# EAGLE design Pico Audio v0.13 (EAGLE 9.4.2)
COMPANY: AKSevenFour; CREVISION: v0.13; DATE: 30-10-2018; DRAWN: Adam Keher; TITLE: TinyPICO Audio Board
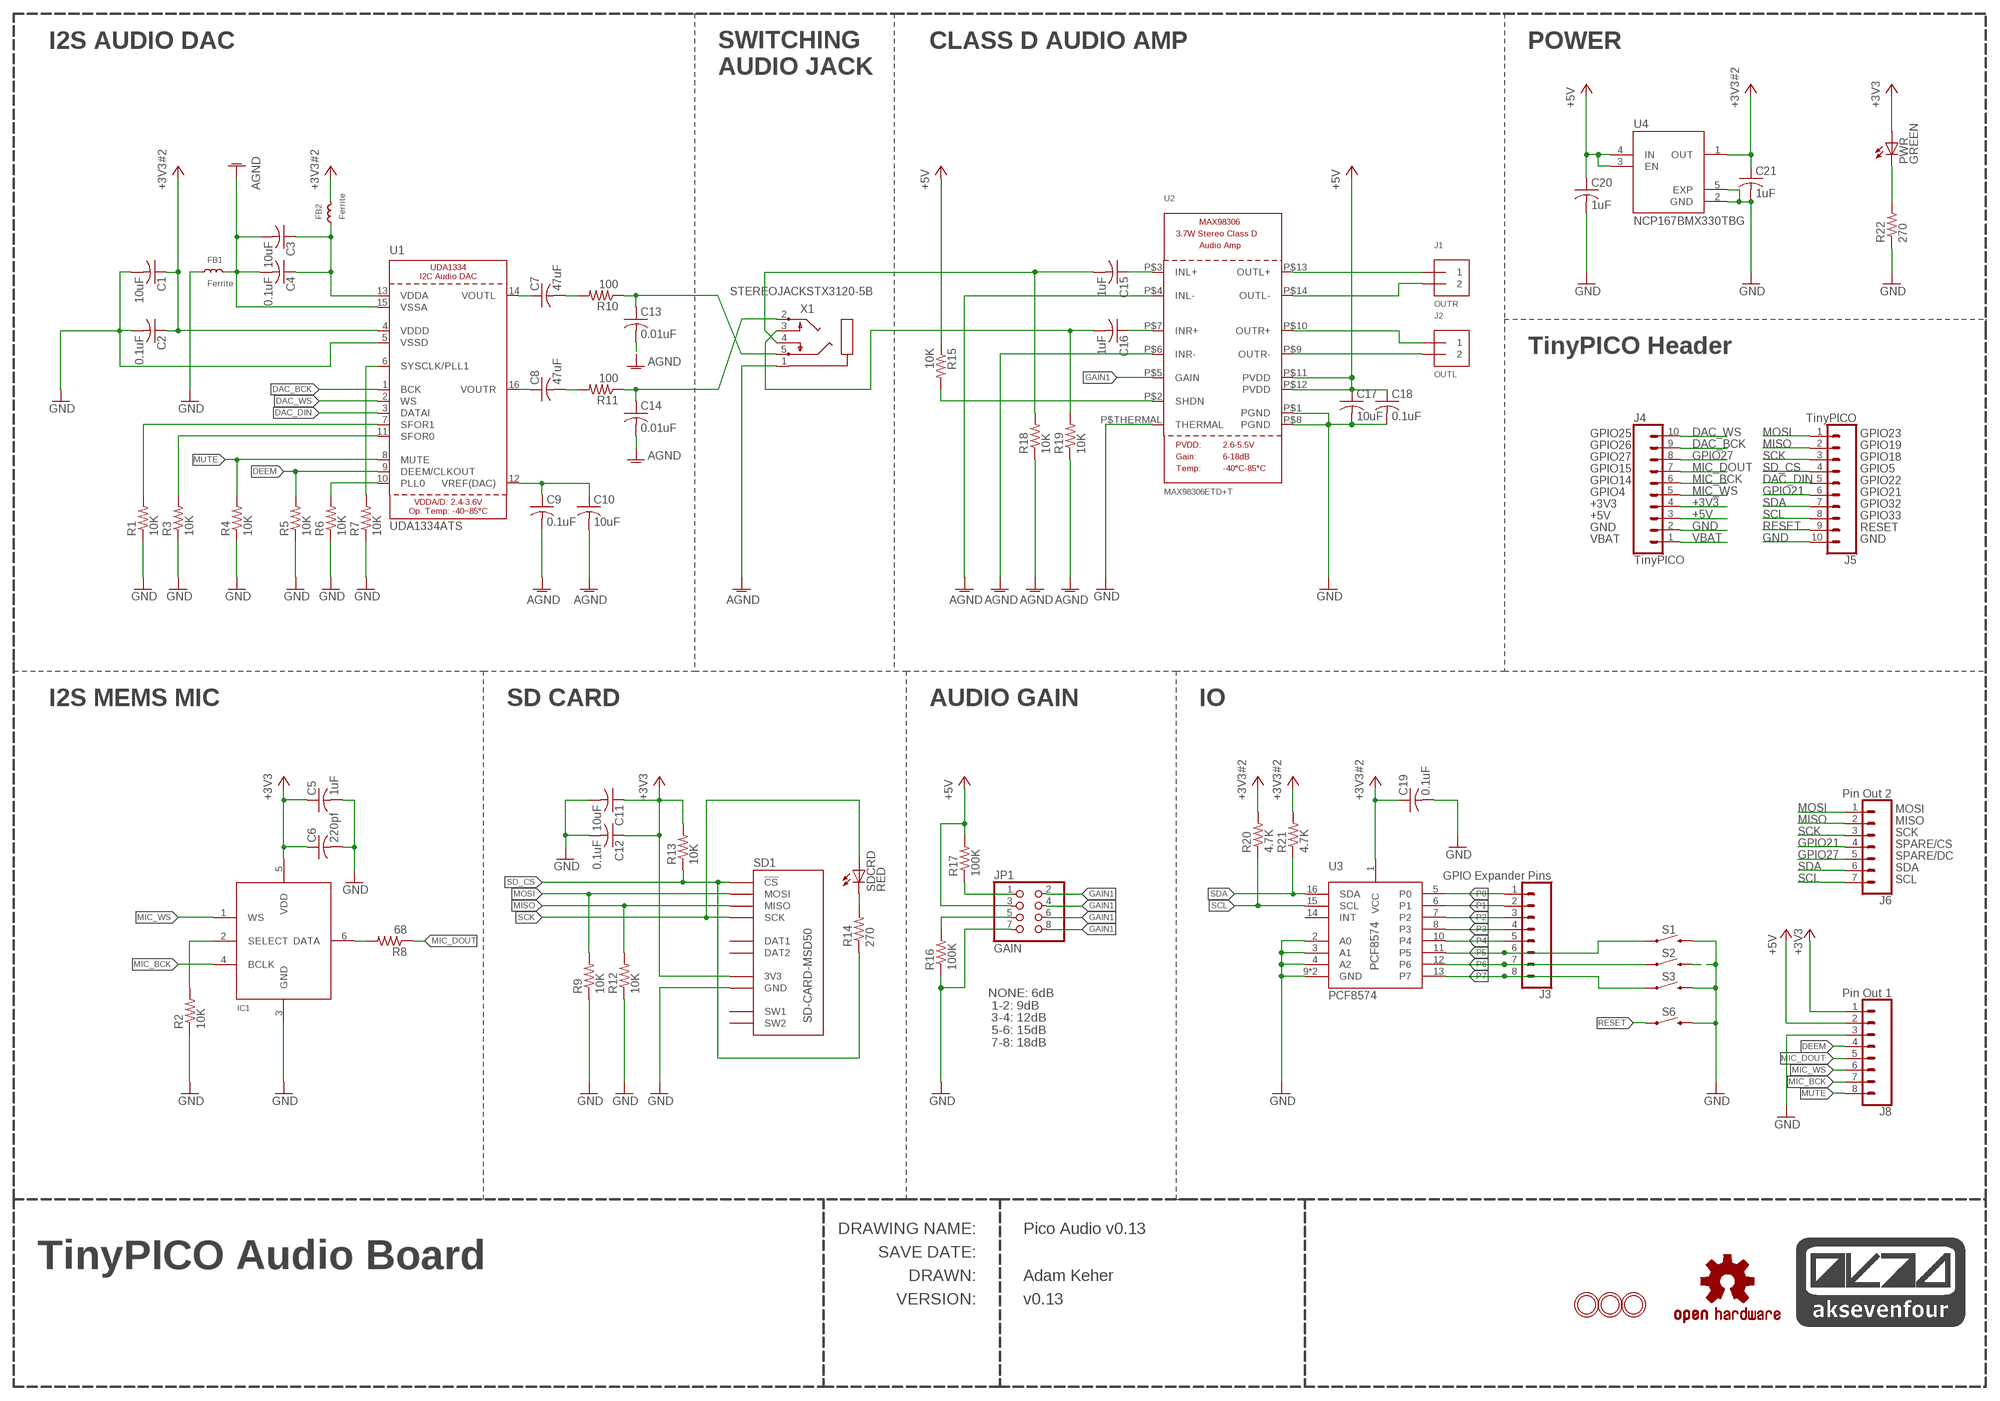
[diagram p0: schematic, sheet 1]

## Parts
AK74LOGO2  AK74_LOGOAK74_LOGO_SMALL  [AK74_LOGO_MEDIUM]
C1  10uF  C-USC0603K  [C0603K]
C2  0.1uF  C-USC0402K  [C0402K]
C3  10uF  C-USC0603K  [C0603K]
C4  0.1uF  C-USC0402K  [C0402K]
C5  1uF  C-USC0402K  [C0402K]
C6  220pf  C-USC0402K  [C0402K]
C7  47uF  C-USC1210K  [C1210K]
C8  47uF  C-USC1210K  [C1210K]
C9  0.1uF  C-USC0402K  [C0402K]
C10  10uF  C-USC0603K  [C0603K]
C11  10uF  C-USC0603K  [C0603K]
C12  0.1uF  C-USC0402K  [C0402K]
C13  0.01uF  C-USC0402K  [C0402K]
C14  0.01uF  C-USC0402K  [C0402K]
C15  1uF  C-USC0402K  [C0402K]
C16  1uF  C-USC0402K  [C0402K]
C17  10uF  C-USC0603K  [C0603K]
C18  0.1uF  C-USC0402K  [C0402K]
C19  0.1uF  C-USC0402K  [C0402K]
C20  1uF  C-USC0402K  [C0402K]
C21  1uF  C-USC0402K  [C0402K]
FB1  Ferrite  FERRITEL0805  [R0805]
FB2  Ferrite  FERRITEL0805  [R0805]
IC1  MIC_I2S_SPH0645  [SPH0645LM4H]
J1  OUTR  TERMBLOCK_1X2  [TERMBLOCK_1X2-3.5MM]
J2  OUTL  TERMBLOCK_1X2  [TERMBLOCK_1X2-3.5MM]
J3  GPIO Expander Pins  CONN_08NO_SILK_FEMALE_PTH  [1X08_NO_SILK]
J4  TinyPICO  TINYPICO_HEADER_10NO_SILK_PTH_FEMALE  [1X10_NO_SILK]
J5  TinyPICO  TINYPICO_HEADER_10NO_SILK_PTH_FEMALE  [1X10_NO_SILK]
J6  Pin Out 2  CONN_07NO_SILK  [1X07_NO_SILK]
J8  Pin Out 1  CONN_08NO_SILK_FEMALE_PTH  [1X08_NO_SILK]
JP1  GAIN  PINHD-2X4  [2X04]
LOGO1  OSHW-LOGOM  [OSHW-LOGO-M]
MH1  MOUNTINGHOLE2.5  [MOUNTINGHOLE_2.5_PLATED]
MH2  MOUNTINGHOLE2.5  [MOUNTINGHOLE_2.5_PLATED]
MH3  MOUNTINGHOLE2.5  [MOUNTINGHOLE_2.5_PLATED]
PWR  GREEN  LEDCHIP-LED0805  [CHIP-LED0805]
R1  10K  R-US_R0402  [R0402]
R2  10K  R-US_R0402  [R0402]
R3  10K  R-US_R0402  [R0402]
R4  10K  R-US_R0402  [R0402]
R5  10K  R-US_R0402  [R0402]
R6  10K  R-US_R0402  [R0402]
R7  10K  R-US_R0402  [R0402]
R8  68  R-US_R0402  [R0402]
R9  10K  R-US_R0402  [R0402]
R10  100  R-US_R0402  [R0402]
R11  100  R-US_R0402  [R0402]
R12  10K  R-US_R0402  [R0402]
R13  10K  R-US_R0402  [R0402]
R14  270  R-US_R0402  [R0402]
R15  10K  R-US_R0402  [R0402]
R16  100K  R-US_R0402  [R0402]
R17  100K  R-US_R0402  [R0402]
R18  10K  R-US_R0402  [R0402]
R19  10K  R-US_R0402  [R0402]
R20  4.7K  R-US_R0402  [R0402]
R21  4.7K  R-US_R0402  [R0402]
R22  270  R-US_R0402  [R0402]
S1  MOMENTARY-SWITCH-SPST-SMD-4.6X2.8MM  [TACTILE_SWITCH_SMD_4.6X2.8MM]
S2  MOMENTARY-SWITCH-SPST-SMD-4.6X2.8MM  [TACTILE_SWITCH_SMD_4.6X2.8MM]
S3  MOMENTARY-SWITCH-SPST-SMD-4.6X2.8MM  [TACTILE_SWITCH_SMD_4.6X2.8MM]
S6  MOMENTARY-SWITCH-SPST-SMD-4.6X2.8MM  [TACTILE_SWITCH_SMD_4.6X2.8MM]
SD1  SD-CARD-MSD50  [SD_5031821853]
SDCRD  RED  LEDCHIP-LED0805  [CHIP-LED0805]
U1  UDA1334ATS  AUDIO_I2S_UDA1334""  [SSOP16_4.4MM]
U2  MAX98306ETD+T  AUDIOAMP_MAX98306  [TDFN14_3X3MM]
U3  PCF8574  [QFN-16-3MM]
U4  NCP170AMX300TCG  [VREG_NCP170AMX300TCG]
X1  STEREOJACKSTX3120-5B  [STX3100]

## Nets
+3V3 [power1]: C5.1 C6.1 C11.1 C12.1 IC1.5(VDD) J4.4 J8.1 PWR.A R13.2 SD1.VCC(3V3)
+3V3#2 [power1]: C1.1 C2.1 C19.1 C21.1 FB2.2 R20.2 R21.2 U1.4(VDDD) U3.1(VCC) U4.1(OUT)
+5V [power1]: C17.1 C18.1 C20.1 J4.3 J8.2 JP1.3 R15.1 R17.2 U2.P$11(PVDD) U2.P$12(PVDD) U4.3(EN) U4.4(IN)
AGND [power1]: C3.2 C4.2 C9.2 C10.2 C13.2 C14.2 FB1.2 R18.1 R19.1 U1.15(VSSA) U2.P$4(INL-) U2.P$6(INR-) X1.1
DAC_BCK: J4.9 U1.1(BCK)
DAC_DIN: J5.5 U1.3(DATAI)
DAC_WS: J4.10 U1.2(WS)
DEEM: J8.4 R5.2 U1.9(DEEM/CLKOUT)
GAIN1: JP1.2 JP1.4 JP1.6 JP1.8 U2.P$5(GAIN)
GND [power1]: C1.2 C2.2 C5.2 C6.2 C11.2 C12.2 C17.2 C18.2 C19.2 C20.2 C21.2 FB1.1 IC1.3(GND) J4.2 J5.10 J8.3 JP1.7 R1.1 R2.1 R3.1 R4.1 R5.1 R6.1 R7.1 R9.1 R12.1 R16.1 R22.1 S1.3 S1.4 S2.3 S2.4 S3.3 S3.4 S6.3 S6.4 SD1.GND U1.5(VSSD) U2.P$1(PGND) U2.P$8(PGND) U2.P$THERMAL(THERMAL) U3.2(A0) U3.3(A1) U3.4(A2) U3.9(GND) U3.P$1(GND) U4.2(GND) U4.5(EXP)
GPIO21: J5.6 J6.4
GPIO27: J4.8 J6.5
MIC_BCK: IC1.4(BCLK) J4.6 J8.7
MIC_DOUT: J4.7 J8.5 R8.1
MIC_WS: IC1.1(WS) J4.5 J8.6
MISO: J5.2 J6.2 R12.2 SD1.MISO
MOSI: J5.1 J6.1 R9.2 SD1.MOSI
MUTE: J8.8 R4.2 U1.8(MUTE)
N$1: C3.1 C4.1 FB2.1 U1.13(VDDA)
N$2: C15.1 U2.P$3(INL+)
N$3: R1.2 U1.7(SFOR1)
N$4: C16.1 U2.P$7(INR+)
N$5: R3.2 U1.11(SFOR0)
N$8: PWR.C R22.2
N$10: R6.2 U1.10(PLL0)
N$11: R7.2 U1.6(SYSCLK/PLL1)
N$14: C9.1 C10.1 U1.12(VREF(DAC))
N$15: C7.1 U1.14(VOUTL)
N$16: C8.2 R11.2
N$17 [power1]: J2.2 U2.P$9(OUTR-)
N$18 [power1]: J1.2 U2.P$14(OUTL-)
N$19: C7.2 R10.2
N$20: IC1.2(SELECT) R2.2
N$21: C8.1 U1.16(VOUTR)
N$22: IC1.6(DATA) R8.2
N$24: JP1.1 R17.1
N$25: JP1.5 R16.2
N$26 [power1]: J1.1 U2.P$13(OUTL+)
N$27: R14.2 SDCRD.C
N$28 [power1]: J2.1 U2.P$10(OUTR+)
P0: J3.1 U3.5(P0)
P1: J3.2 U3.6(P1)
P2: J3.3 U3.7(P2)
P3: J3.4 U3.8(P3)
P4: J3.5 U3.10(P4)
P5: J3.6 S1.1 S1.2 U3.11(P5)
P6: J3.7 S2.1 S2.2 U3.12(P6)
P7: J3.8 S3.1 S3.2 U3.13(P7)
RESET: J5.9 S6.1 S6.2
SCK: J5.3 J6.3 SD1.SCK SDCRD.A
SCL: J5.8 J6.7 R20.1 U3.15(SCL)
SD_CS: J5.4 R13.1 R14.1 SD1.CS(!CS)
SDA: J5.7 J6.6 R21.1 U3.16(SDA)
SHUTDOWN: R15.2 U2.P$2(SHDN)
VBAT [power1]: J4.1
VINL [power1]: C15.2 R18.2 X1.4
VINR [power1]: C16.2 R19.2 X1.3
VOUTL [power1]: C13.1 R10.1 X1.5
VOUTR [power1]: C14.1 R11.1 X1.2
Unconnected: SD1.DAT1 SD1.DAT2 SD1.SW1 SD1.SW2 U3.14(INT)

## Notes on the sheet
- I2S AUDIO DAC | CLASS D AUDIO AMP | POWER
- SWITCHING
  AUDIO JACK
- NCP167BMX330TBG
- TinyPICO Header
- GPIO25 | GPIO23
- GPIO26 | GPIO19
- GPIO27 | GPIO18
- GPIO15 | GPIO5
- GPIO14 | GPIO22
- GPIO4 | GPIO21
- +3V3 | GPIO32
- +5V | GPIO33
- GND | RESET
- VBAT | GND
- I2S MEMS MIC | SD CARD | AUDIO GAIN | IO
- MOSI
- MISO
- SCK
- SPARE/CS
- SPARE/DC
- SDA
- SCL
- NONE: 6dB
   1-2: 9dB
   3-4: 12dB
   5-6: 15dB
   7-8: 18dB
- DRAWING NAME:
- SAVE DATE:
- DRAWN:
- VERSION:

## Library data of the parts
AK74LOGO2 = AK74:AK74_LOGO
C1-C21 = rcl:C-US: CAPACITOR, American symbol; SPICEPREFIX: C
FB1 FB2 = AK74:FERRITE
IC1 = microbuilder:MIC_I2S
J1 J2 = microbuilder:TERMBLOCK_1X2: 3.5mm Terminal block http://www.ladyada.net/library/pcb/eaglelibrary.html
J3 J8 = SparkFun-Connectors:CONN_08: Multi connection point. Often used as Generic Header-pin footprint for 0.1 inch spaced/style header connections On any of the 0.1 inch spaced packages, you can populate with these: Break Away Headers - Straight (PRT-00116) Break Away Male Headers - Right Angle (PRT-00553) Female Headers (PRT-00115) Break Away Headers - Machine Pin (PRT-00117) Break Away Female Headers - Swiss Machine Pin (PRT-00743) Arduino Stackable Header - 8 Pin (PRT-09279) For SCREWTERMINALS and SPRING TERMINALS visit here: Screw Terimnals on SparkFun.com (5mm/3.5mm/2.54mm spacing) This device is also useful as a general connection point to wire up your design to another part of your project. Our various solder wires solder well into these plated through hole pads. Hook-Up Wire - Assortment (Stranded, 22 AWG) (PRT-11375) Hook-Up Wire - Assortment (Solid Core, 22 AWG) (PRT-11367) View the entire wire category on our website here Special notes: Molex polarized connector foot print use with SKU : PRT-08231 with associated crimp pins and housings. 1MM SMD Version SKU: PRT-10208 NOTES ON THE VARIANTS LOCK and LOCK_LONGPADS... This footprint was designed to help hold the alignment of a through-hole component (i.e. 6-pin header) while soldering it into place. You may notice that each hole has been shifted either up or down by 0.005 of an inch from it's more standard position (which is a perfectly straight line). This slight alteration caused the pins (the squares in the middle) to touch the edges of the holes. Because they are alternating, it causes a "brace" to hold the component in place. 0.005 has proven to be the perfect amount of "off-center" position when using our standard breakaway headers. Although looks a little odd when you look at the bare footprint, once you have a header in there, the alteration is very hard to notice. Also,if you push a header all the way into place, it is covered up entirely on the bottom side.; PROD_ID: CONN-08438
J4 J5 = UnexpectedMaker:TINYPICO_HEADER_10: Multi connection point. Often used as Generic Header-pin footprint for 0.1 inch spaced/style header connections On any of the 0.1 inch spaced packages, you can populate with these: Break Away Headers - Straight (PRT-00116) Break Away Male Headers - Right Angle (PRT-00553) Female Headers (PRT-00115) Break Away Headers - Machine Pin (PRT-00117) Break Away Female Headers - Swiss Machine Pin (PRT-00743) Arduino Stackable Header - 10 Pin (PRT-11376) For SCREWTERMINALS and SPRING TERMINALS visit here: Screw Terimnals on SparkFun.com (5mm/3.5mm/2.54mm spacing) This device is also useful as a general connection point to wire up your design to another part of your project. Our various solder wires solder well into these plated through hole pads. Hook-Up Wire - Assortment (Stranded, 22 AWG) (PRT-11375) Hook-Up Wire - Assortment (Solid Core, 22 AWG) (PRT-11367) View the entire wire category on our website here Special notes: Molex polarized connector foot print use with SKU : PRT-08231 with associated crimp pins and housings. 1MM SMD Version SKU: PRT-10208 NOTES ON THE VARIANTS LOCK and LOCK_LONGPADS... This footprint was designed to help hold the alignment of a through-hole component (i.e. 6-pin header) while soldering it into place. You may notice that each hole has been shifted either up or down by 0.005 of an inch from it's more standard position (which is a perfectly straight line). This slight alteration caused the pins (the squares in the middle) to touch the edges of the holes. Because they are alternating, it causes a "brace" to hold the component in place. 0.005 has proven to be the perfect amount of "off-center" position when using our standard breakaway headers. Although looks a little odd when you look at the bare footprint, once you have a header in there, the alteration is very hard to notice. Also,if you push a header all the way into place, it is covered up entirely on the bottom side.; PROD_ID: CONN-11563
J6 = SparkFun-Connectors:CONN_07: Multi connection point. Often used as Generic Header-pin footprint for 0.1 inch spaced/style header connections On any of the 0.1 inch spaced packages, you can populate with these: Break Away Headers - Straight (PRT-00116) Break Away Male Headers - Right Angle (PRT-00553) Female Headers (PRT-00115) Break Away Headers - Machine Pin (PRT-00117) Break Away Female Headers - Swiss Machine Pin (PRT-00743) For SCREWTERMINALS and SPRING TERMINALS visit here: Screw Terimnals on SparkFun.com (5mm/3.5mm/2.54mm spacing) This device is also useful as a general connection point to wire up your design to another part of your project. Our various solder wires solder well into these plated through hole pads. Hook-Up Wire - Assortment (Stranded, 22 AWG) (PRT-11375) Hook-Up Wire - Assortment (Solid Core, 22 AWG) (PRT-11367) View the entire wire category on our website here Special notes: Molex polarized connector foot print use with SKU : PRT-08231 with associated crimp pins and housings. 1MM SMD Version SKU: PRT-10208 NOTES ON THE VARIANTS LOCK and LOCK_LONGPADS... This footprint was designed to help hold the alignment of a through-hole component (i.e. 6-pin header) while soldering it into place. You may notice that each hole has been shifted either up or down by 0.005 of an inch from it's more standard position (which is a perfectly straight line). This slight alteration caused the pins (the squares in the middle) to touch the edges of the holes. Because they are alternating, it causes a "brace" to hold the component in place. 0.005 has proven to be the perfect amount of "off-center" position when using our standard breakaway headers. Although looks a little odd when you look at the bare footprint, once you have a header in there, the alteration is very hard to notice. Also,if you push a header all the way into place, it is covered up entirely on the bottom side.
JP1 = pinhead:PINHD-2X4: PIN HEADER
LOGO1 = SparkFun-Aesthetics:OSHW-LOGO: Open-Source Hardware (OSHW) Logo This logo indicates the piece of hardware it is found on incorporates a OSHW license and/or adheres to the definition of open source hardware found here: http://freedomdefined.org/OSHW
MH1-MH3 = microbuilder:MOUNTINGHOLE: Mounting Hole For #2 screws (0.086"/2.18mm width, 0.094"/2.4mm hole) use 2.5mm
PWR SDCRD = led:LED: LED OSRAM: - CHIPLED LG R971, LG N971, LY N971, LG Q971, LY Q971, LO R971, LY R971 LH N974, LH R974 LS Q976, LO Q976, LY Q976 LO Q996 - Hyper CHIPLED LW Q18S LB Q993, LB Q99A, LB R99A - SideLED LS A670, LO A670, LY A670, LG A670, LP A670 LB A673, LV A673, LT A673, LW A673 LH A674 LY A675 LS A676, LA A676, LO A676, LY A676, LW A676 LS A679, LY A679, LG A679 - Hyper Micro SIDELED® LS Y876, LA Y876, LO Y876, LY Y876 LT Y87S - SmartLED LW L88C, LW L88S LB L89C, LB L89S, LG L890 LS L89K, LO L89K, LY L89K LS L896, LA L896, LO L896, LY L896 - TOPLED LS T670, LO T670, LY T670, LG T670, LP T670 LSG T670, LSP T670, LSY T670, LOP T670, LYG T670 LG T671, LOG T671, LSG T671 LB T673, LV T673, LT T673, LW T673 LH T674 LS T676, LA T676, LO T676, LY T676, LB T676, LH T676, LSB T676, LW T676 LB T67C, LV T67C, LT T67C, LS T67K, LO T67K, LY T67K, LW E67C LS E67B, LA E67B, LO E67B, LY E67B, LB E67C, LV E67C, LT E67C LW T67C LS T679, LY T679, LG T679 LS T770, LO T770, LY T770, LG T770, LP T770 LB T773, LV T773, LT T773, LW T773 LH T774 LS E675, LA E675, LY E675, LS T675 LS T776, LA T776, LO T776, LY T776, LB T776 LHGB T686 LT T68C, LB T68C - Hyper Mini TOPLED® LB M676 - Mini TOPLED Santana® LG M470 LS M47K, LO M47K, LY M47K Source: http://www.osram.convergy.de LUXEON: - LUMILED® LXK2-PW12-R00, LXK2-PW12-S00, LXK2-PW14-U00, LXK2-PW14-V00 LXK2-PM12-R00, LXK2-PM12-S00, LXK2-PM14-U00 LXK2-PE12-Q00, LXK2-PE12-R00, LXK2-PE12-S00, LXK2-PE14-T00, LXK2-PE14-U00 LXK2-PB12-K00, LXK2-PB12-L00, LXK2-PB12-M00, LXK2-PB14-N00, LXK2-PB14-P00, LXK2-PB14-Q00 LXK2-PR12-L00, LXK2-PR12-M00, LXK2-PR14-Q00, LXK2-PR14-R00 LXK2-PD12-Q00, LXK2-PD12-R00, LXK2-PD12-S00 LXK2-PH12-R00, LXK2-PH12-S00 LXK2-PL12-P00, LXK2-PL12-Q00, LXK2-PL12-R00 Source: www.luxeon.com KINGBRIGHT: KA-3528ASYC Source: www.kingbright.com
R1-R22 = rcl:R-US_: RESISTOR, American symbol; SPICEPREFIX: R
S1-S3 S6 = SparkFun-Switches:MOMENTARY-SWITCH-SPST: Momentary Switch (Pushbutton) - SPST Normally-open (NO) SPST momentary switches (buttons, pushbuttons). Variants PTH-12MM - 12mm square, through-hole Momentary Pushbutton Switch - 12mm Square (COM-09190) PTH-6.0MM, PTH-6.0MM-KIT - 6.0mm square, through-hole Mini Pushbutton Switch (COM-00097) KIT package intended for soldering kit's - only one side of pads' copper is exposed. PTH-RIGHT-ANGLE-KIT - Right-angle, through-hole Right Angle Tactile Button - Used on SparkFun BigTime Watch Kit SMD-12MM - 12mm square, surface-mount Tactile Button - SMD (12mm) (COM-12993) Used on SparkFun PicoBoard SMD-4.5MM - 4.5mm Square Trackball Switch Used on SparkFun Blackberry Trackballer Breakout SMD-4.6MMX2.8MM - 4.60mm x 2.80mm, surface mount Used on SparkFun SAMD21 Mini Breakout SMD-5.2MM, SMD-5.2-REDUNDANT - 5.2mm square, surface-mount Mini Pushbutton Switch - SMD (COM-08720) Used on Arduino Pro Mini REDUNDANT package connects both switch circuits together SMD-6.0X3.5MM - 6.0 x 3.5mm, surface mount Momentary Reset Switch SMD (COM-08229) SMD-6.2MM-TALL - 6.2mm square, surface mount Tactile Button - SMD (6mm) Used on SparkFun Digital Sandbox SMD-RIGHT-ANGLE - Right-angle, surface mount Used on SparkFun Block for Intel® Edison - Arduino; PROD_ID: SWCH-13065
SD1 = we-con:SD-CARD: SD-Card Sockets; DIGIKEY: WM9750TR-ND
U1 = microbuilder:AUDIO_I2S_UDA1334: UDA1334 I2C Audio DAC Power Supply: 2.4-3.6V Sample frequencies from 16-100kHz
U2 = microbuilder:AUDIOAMP_MAX98306: MAX98306 3.7W Stereo Audio Amp - TDFN14 3.7W @ 3 ohm, 2.6-5.5V supply, 6-18dB selectable gain
U3 = AK74:PCF8574
U4 = NCP170AMX300TCG:NCP170AMX300TCG: Fixed LDO Voltage Regulator, 2.2V to 5.5V, 190mV Dropout, 3Vout, 150mAout, XDFN-4; AVAILABILITY: Unavailable; DESCRIPTION: Fixed LDO Voltage Regulator, 2.2V to 5.5V, 190mV Dropout, 3Vout, 150mAout, XDFN-4; MF: ON Semiconductor; MP: NCP170AMX300TCG; PACKAGE: XDFN-4 ON Semiconductor; PRICE: None
X1 = AK74:STEREOJACK: MIC/HEADPHONE JACK Stereo jack with two switches. Kycon STX3100, CUI SJ1-3555NG and/or 4UCon 05544

## Net classes
0 default: width 0.152 mm
1 power1: width 0.254 mm

## Board
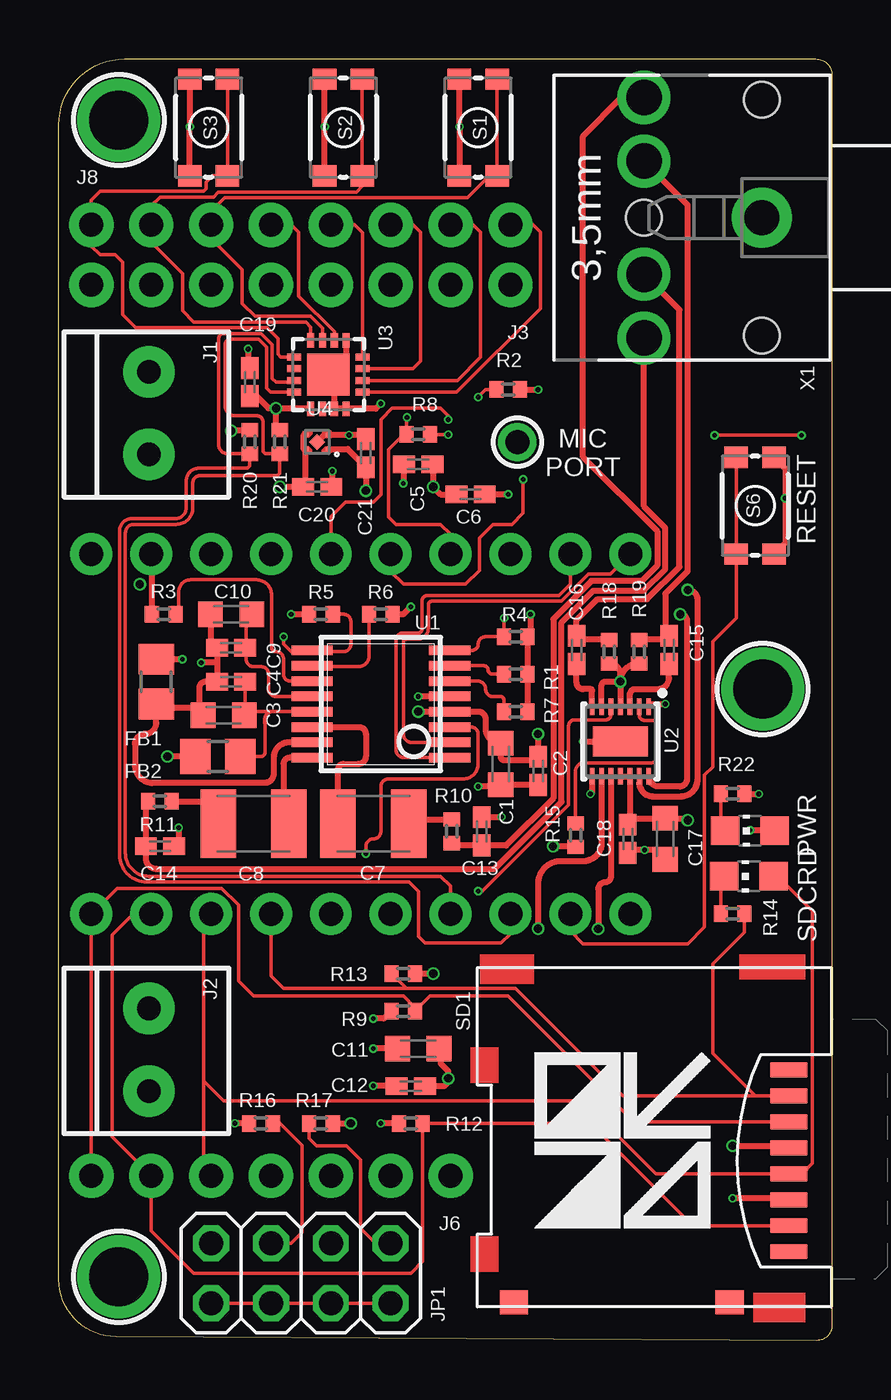
[diagram p1: board, top side]
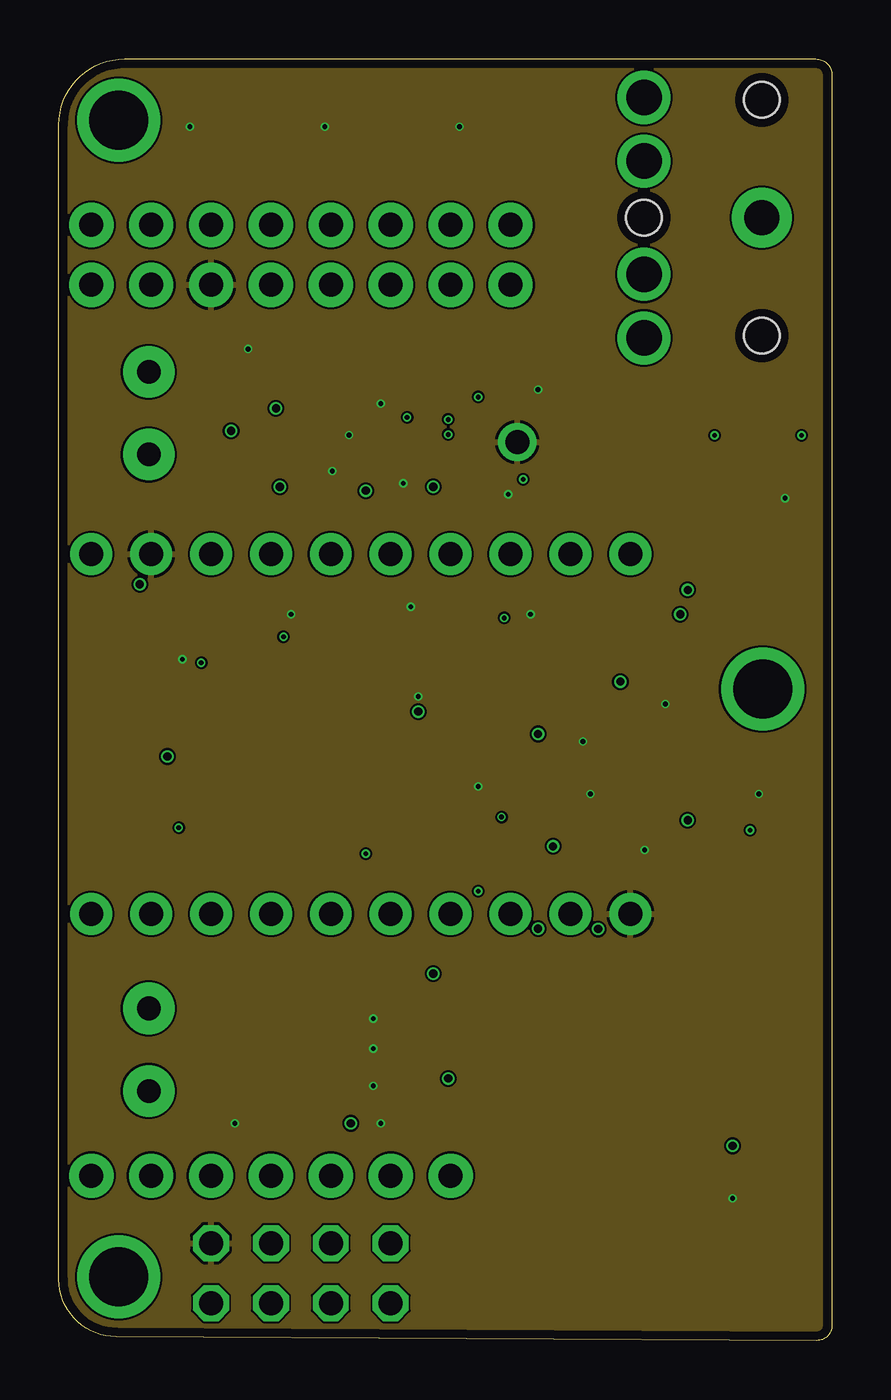
[diagram p2: board, inner layer GND]
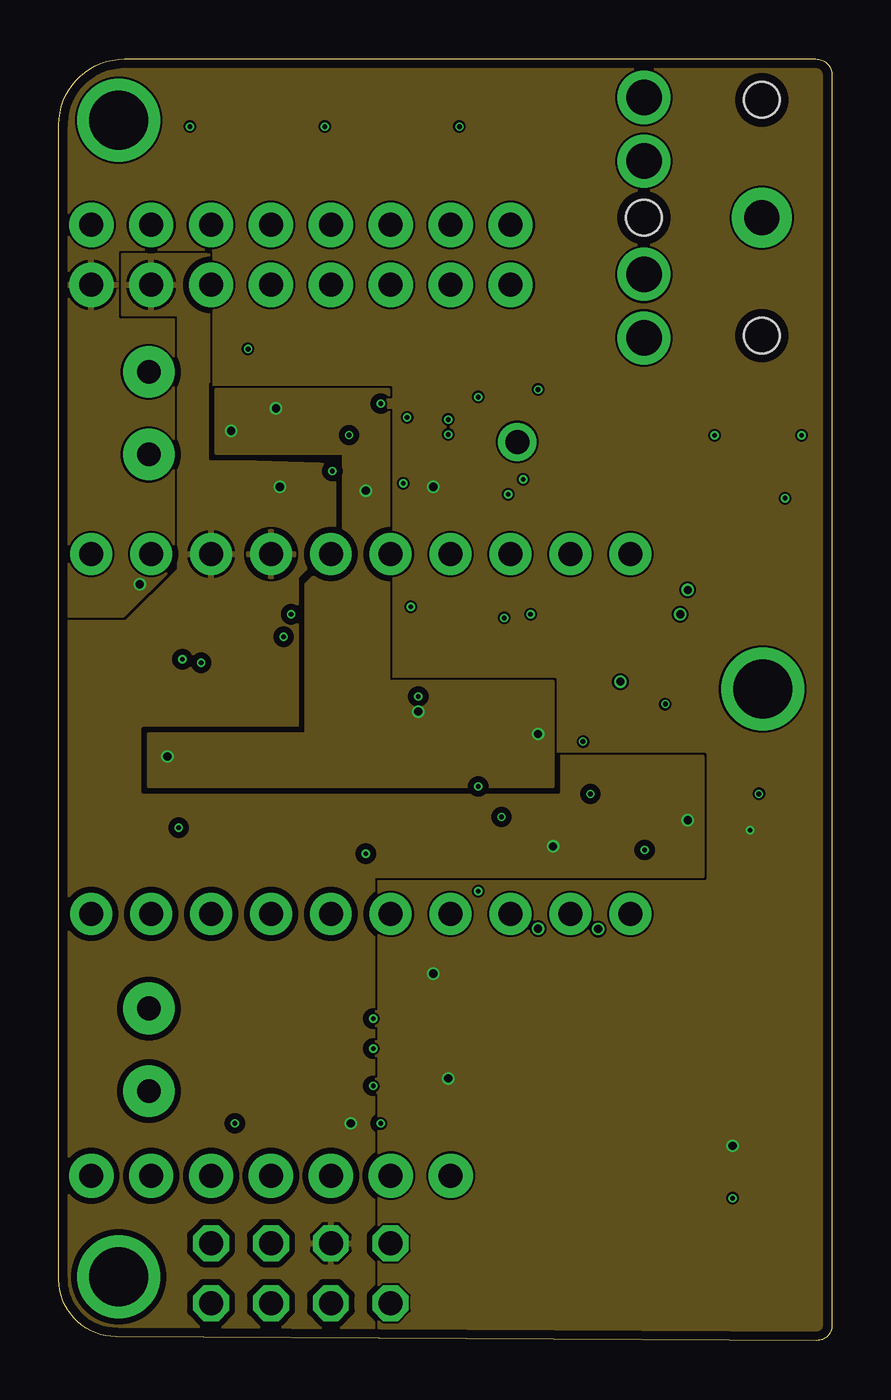
[diagram p3: board, inner layer PWR]
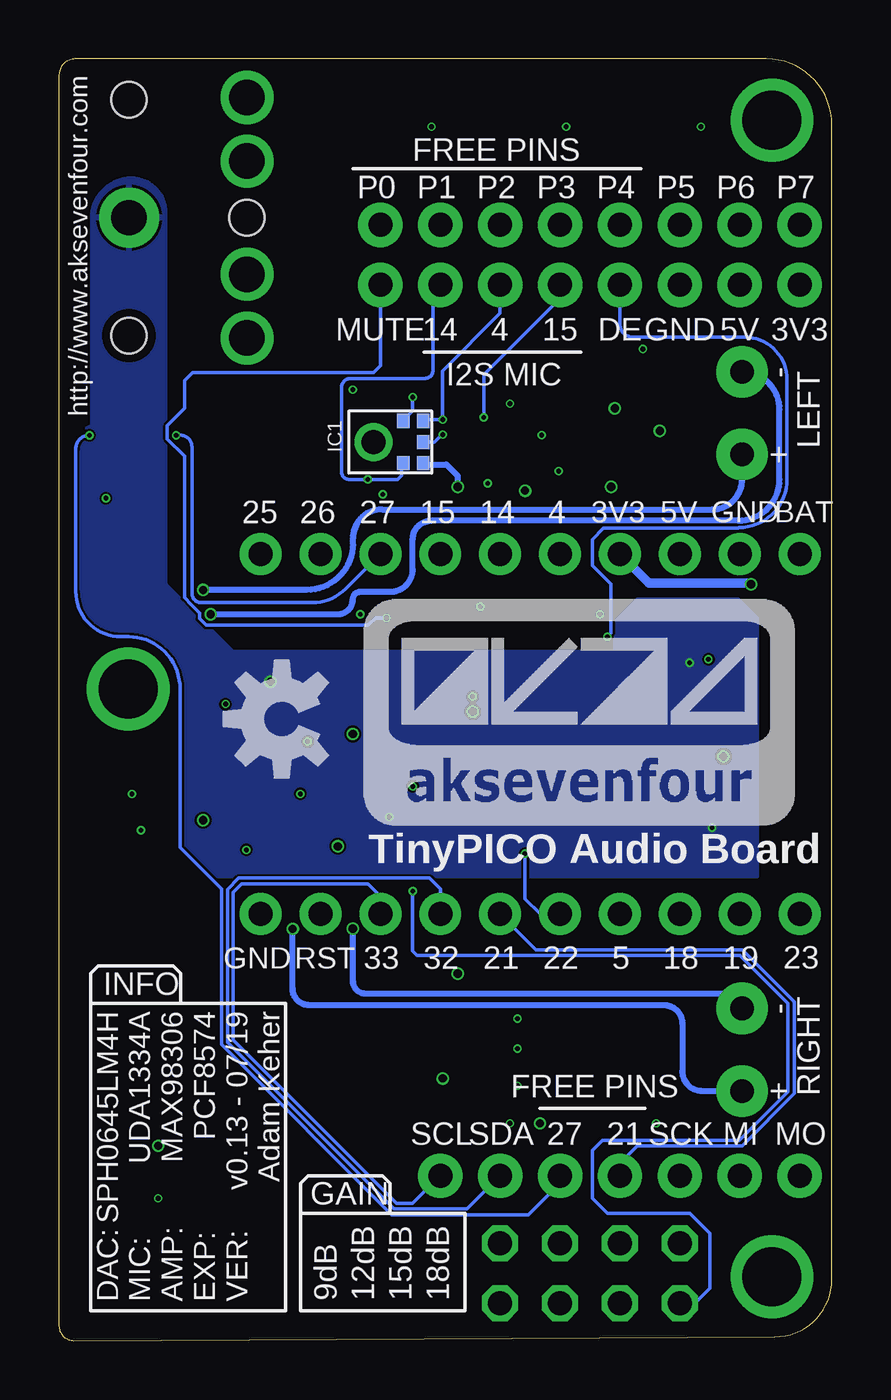
[diagram p4: board, bottom side, seen from below]

Size 32.79 x 54.35 mm. Coordinates in mm from the lower left corner, seen from the top.
Outline: 2.78,54.34 32.11,54.34 arc-90 32.78,53.67 32.78,0.63 arc-90 32.15,0 2.43,0.16 arc-90 0,2.59 0,51.56 arc-90 2.78,54.34
Copper layers (1+2*15+16): Top 0.07mm / dielectric 1.5mm / GND 0.035mm / dielectric 0.15mm / PWR 0.035mm / dielectric 0.2mm / Bottom 0.07mm
Design rules "jlcpcb-4layer-updated": minimum track width 3.5mil, minimum drill 0.2mm, track to track 3.5mil, track to pad 5mil, pad to pad 5mil, via to via 5mil, smd to smd 5mil, copper to edge 15mil, drill to drill 5mil, minimum pad ring 7mil, minimum via ring 3mil, stop-mask expansion 3mil, vias tented up to drill 20mil, thermal gap 5mil

### Footprints (pad centres in the part's own frame; a part is rotated, then mirrored left to right if it is on the bottom)
C0603K = smd 1.05 x 1.08: 1 -0.875,0; 2 0.875,0
C0402K = smd 0.925 x 0.74: 1 -0.6,0; 2 0.6,0
C1210K = smd 1.5 x 2.9: 1 -1.5,0; 2 1.5,0
R0805 = smd 1.3 x 1.5: 1 -0.95,0; 2 0.95,0
SPH0645LM4H = smd 0.6 x 0.525: 1 -0.9,1.4; 2 -0.9,0.55; 4 0.9,0.55; 5 0.9,1.4; 6 0,1.4 | drill 1.025 pad 1.625: 3 0,-0.71
TERMBLOCK_1X2-3.5MM = drill 1 pad 2.184: 1 1.8,0; 2 -1.7,0
1X08_NO_SILK = drill 1.016 pad 1.88: 1 0,0; 2 2.54,0; 3 5.08,0; 4 7.62,0; 5 10.16,0; 6 12.7,0; 7 15.24,0; 8 17.78,0
1X10_NO_SILK = drill 1.016 pad 1.778: 1 0,0; 2 2.54,0; 3 5.08,0; 4 7.62,0; 5 10.16,0; 6 12.7,0; 7 15.24,0; 8 17.78,0; 9 20.32,0; 10 22.86,0
1X07_NO_SILK = drill 1.016 pad 1.88: 1 0,0; 2 2.54,0; 3 5.08,0; 4 7.62,0; 5 10.16,0; 6 12.7,0; 7 15.24,0
2X04 = drill 1.016 octagon: 1 -3.81,-1.27; 2 -3.81,1.27; 3 -1.27,-1.27; 4 -1.27,1.27; 5 1.27,-1.27; 6 1.27,1.27; 7 3.81,-1.27; 8 3.81,1.27
MOUNTINGHOLE_2.5_PLATED = drill 2.5 pad 3.2: P$1 0,0
CHIP-LED0805 = smd 1.2 x 1.2: A 0,-1.05; C 0,1.05
R0402 = smd 0.6 x 0.7: 1 -0.5,0; 2 0.5,0
TACTILE_SWITCH_SMD_4.6X2.8MM = smd 0.9 x 1: 1 -2.05,-0.8; 2 2.05,-0.8; 3 2.05,0.8; 4 -2.05,0.8
SD_5031821853 = smd 0.65 x 1.6: CS 2.75,0.8; DAT1 -3.85,0.8; DAT2 3.85,0.8; GND -1.65,0.8; MISO -2.75,0.8; MOSI 1.65,0.8; SCK -0.55,0.8; VCC 0.55,0.8 | smd 1 x 1.2: SW1 -6,12.45; SW2 -6,3.3
SSOP16_4.4MM = smd 0.4 x 1.75: 1 -2.275,-2.92; 2 -1.625,-2.92; 3 -0.975,-2.92; 4 -0.325,-2.92; 5 0.325,-2.92; 6 0.975,-2.92; 7 1.625,-2.92; 8 2.275,-2.92; 9 2.275,2.92; 10 1.625,2.92; 11 0.975,2.92; 12 0.325,2.92; 13 -0.325,2.92; 14 -0.975,2.92; 15 -1.625,2.92; 16 -2.275,2.92
TDFN14_3X3MM = smd 0.7 x 0.2: P$1 -1.475,1.2; P$2 -1.475,0.8; P$3 -1.475,0.4; P$4 -1.475,0; P$5 -1.475,-0.4; P$6 -1.475,-0.8; P$7 -1.475,-1.2; P$8 1.475,-1.2; P$9 1.475,-0.8; P$10 1.475,-0.4; P$11 1.475,0; P$12 1.475,0.4; P$13 1.475,0.8; P$14 1.475,1.2 | smd 1.27 x 2.35: P$THERMAL 0,0
QFN-16-3MM = smd 0.6 x 0.3: 1 -1.45,0.75; 2 -1.45,0.25; 3 -1.45,-0.25; 4 -1.45,-0.75; 9 1.45,-0.75; 10 1.45,-0.25; 11 1.45,0.25; 12 1.45,0.75 | smd 0.3 x 0.6: 5 -0.75,-1.45; 6 -0.25,-1.45; 7 0.25,-1.45; 8 0.75,-1.45; 13 0.75,1.45; 14 0.25,1.45; 15 -0.25,1.45; 16 -0.75,1.45 | smd 1.8 x 1.8: P$1 0,0
VREG_NCP170AMX300TCG = smd 0.152 x 0.152: 1 -0.45,0.3; 2 -0.45,-0.3; 3 0.45,-0.3; 4 0.45,0.3 | smd 0.483 x 0.483 rotated 315: 5 0,0
STX3100 = drill 1.5 pad 2.54: 1 2.7,-0.1 | drill 1.5: 2 7.7,5; 3 7.7,2.3; 4 7.7,-2.5; 5 7.7,-5.2 | hole 1.5: 2.7,4.9; 2.7,-5.1; 7.7,-0.1

### Placement (x,y rotation side)
AK74LOGO2  10.95,28.2 0 bottom
C1  18.73,24.45 270 top
C2  20.32,24.16 270 top
C3  6.99,26.51 180 top
C4  7.3,27.94 180 top
C5  15.24,37.15 180 top
C6  17.46,35.88 0 top
C7  13.34,21.91 0 top
C8  8.26,21.91 180 top
C9  7.3,29.37 180 top
C10  7.3,30.8 180 top
C11  15.24,12.38 180 top
C12  14.92,10.8 180 top
C13  17.94,21.59 90 top
C14  4.29,20.96 0 top
C15  25.88,29.29 90 top
C16  21.96,29.29 90 top
C17  25.72,21.27 270 top
C18  24.13,21.27 270 top
C19  8.1,40.64 90 top
C20  10.95,36.2 0 top
C21  13.02,37.63 90 top
FB1  4.13,27.94 270 top
FB2  6.74,24.77 180 top
IC1  18.73,38.1 270 bottom
J1  3.81,39.37 270 top
J2  3.81,12.38 270 top
J3  19.15,47.31 180 top
J4  1.37,33.35 0 top
J5  1.37,18.09 0 top
J6  1.37,6.99 0 top
J8  1.37,44.77 0 top
JP1  10.26,2.86 180 top
LOGO1  23.34,26.35 90 bottom
MH1  29.84,27.62 0 top
MH2  2.54,51.75 0 top
MH3  2.54,2.7 0 top
PWR  29.3,21.62 90 top
R1  19.37,28.26 180 top
R2  19.05,40.32 180 top
R3  4.45,30.8 0 top
R4  19.37,29.85 180 top
R5  11.11,30.8 0 top
R6  13.65,30.8 180 top
R7  19.37,26.67 180 top
R8  15.24,38.42 0 top
R9  14.61,13.97 0 top
R10  16.67,21.59 90 top
R11  4.29,22.86 0 top
R12  14.92,9.21 0 top
R13  14.61,15.56 0 top
R14  28.57,18.1 180 top
R15  21.91,21.43 90 top
R16  8.57,9.21 0 top
R17  11.11,9.21 0 top
R18  24.61,29.21 90 top
R19  23.34,29.21 90 top
R20  8.1,38.1 90 top
R21  9.37,38.1 90 top
R22  28.57,23.18 180 top
S1  17.78,51.44 90 top
S2  12.06,51.44 90 top
S3  6.35,51.44 90 top
S6  29.53,35.4 270 top
SD1  31.75,7.62 90 top
SDCRD  29.26,19.69 90 top
U1  13.65,26.99 90 top
U2  23.81,25.4 270 top
U3  11.43,40.96 90 top
U4  10.95,38.1 180 top
U$1  [AK74_LOGO_MEDIUM_TEXTONLY_SQUARE]  27.46,10.64 0 top
X1  32.51,47.51 180 top

### Tracks (layer width: path | path; a pad name or v marks a point on that pad's centre or on a via)
+3V3  (via drill 0.2, 0.35)
  Top 0.254: C12.1 16.35,10.8 16.51,10.96 v16.51,11.11 16.51,11.43 16.19,11.75 16.19,12.31 C11.1 | R13.2 v15.88,15.56 | v28.57,8.26 30.86,8.26 SD1.VCC | C5.1 15.88,37.11 v15.88,36.2 16.19,35.88 C6.1 | v29.31,21.64 30.32,21.64 PWR.A
  Bottom 0.254: IC1.5 17.28,37.15 16.35,37.15 15.88,36.67 v15.88,36.2
  Bottom 0.406: J4.4 7.76,32.12 3.48,32.12 v3.43,32.07
  pour PWR (rank 3): -1.27,55.56 -1.27,-1.11 33.97,-1.11 33.97,55.56
+3V3#2  (via drill 0.35)
  Top 0.254: FB2.2 v4.6,24.77 | v15.24,26.67 U1.4 | U1.4 | U1.4 arc-90 U1.4 | U1.4 17.78,26.67 arc-90 18.1,26.35 18.1,25.96 arc90 C1.1 18.73,24.77 arc90 18.89,24.61 20.17,24.61 arc90 C2.1 v20.32,25.72 | U4.1 12.24,37.8 C21.1 v13.02,36.04 | v9.21,39.53 8.89,39.53 8.38,40.04 C19.1 | v9.21,39.53 10.66,39.53 U3.1 | R21.2 arc-90 9.21,38.76 v9.21,39.53 | R20.2 arc-90 8.07,38.58 v7.3,38.58
  pour PWR (isolate 0.254): 3.81,25.72 3.81,23.5 20.95,23.5 20.95,27.94 13.97,27.94 13.97,40.32 6.67,40.32 6.67,37.63 12.06,37.63 12.06,33.66 10.48,32.07 10.48,25.72
+5V  (via drill 0.35)
  Top 0.254: v26.67,22.07 26.59,22.15 C17.1 24.41,22.15 C18.1 24.21,21.96 U2.P$12 U2.P$11 | R15.1 21.88,20.96 v20.95,20.96 | U4.3 10.39,38.4 10.36,38.37 10.36,37.84 10.39,37.8 U4.4 10.43,37.73 10.43,36.27 C20.1 v9.37,36.2 | R17.2 v12.38,9.21
  pour PWR (isolate 0.254, rank 2): 27.3,19.69 27.3,24.77 21.27,24.77 21.27,23.18 10.16,23.18 10.16,32.39 11.75,33.97 11.75,37.15 6.35,37.31 6.35,46.04 2.7,46.04 2.7,43.5 5.08,43.5 5.08,32.7 2.86,30.48 -0.95,30.48 -0.95,-0.79 13.34,-0.79 13.34,19.69
AGND  (via drill 0.2, 0.35)
  Top 0.254: v23.81,27.94 U2.P$4 | U2.P$6 23.01,27.78 arc-90 23.18,27.94 v23.81,27.94 | C13.2 17.95,22.2 v18.77,22.2 | v5.08,21.75 5.08,21.15 C14.2 | U1.15 9.75,25.36 arc90 9.11,24.72 9.11,24.03 arc-90 8.72,23.65 3.98,23.65 arc-90 3.23,24.4 3.23,25.29 arc-90 3.65,25.72 arc90 4.13,26.2 FB1.2 4.29,26.83 5.79,26.83 C3.2 5.95,26.67 5.95,27.67 arc-90 6.23,27.94 C4.2 6.7,28.74 | C10.2 6.43,29.65 arc90 C9.2 6.7,28.74 | 6.7,28.74 v6.04,28.74 v6.03,28.74 | v23.81,27.94 23.81,28.24 arc90 R19.1 | v23.81,27.94 arc-90 24.58,28.71 R18.1
  pour Bottom: 3.17,30.65 3.17,19.69 32.34,19.69 32.34,37.37 arc67 31.39,38.79 31.39,47.61 arc90 29.72,49.29 arc90 28.26,47.83 28.26,32.07 25.4,29.21 9.21,29.21 9.21,30.48 8.26,31.43 3.96,31.43
DAC_BCK
  Top 0.152: U1.1 14.66,24.71 arc-90 14.29,25.08 14.29,29.69 arc-90 14.61,30.01 15.24,30.01 arc90 15.4,30.16 15.4,31.37 arc-90 15.62,31.59 21.2,31.59 21.69,32.08 J4.9
DAC_DIN  (via drill 0.2)
  Top 0.152: U1.3 17.48,26.01 arc-90 17.78,25.72 17.78,24.45 arc-90 17.14,23.81 13.97,23.81 arc90 13.65,23.5 13.65,21.59 arc-90 13.34,21.27 arc90 13.02,20.96 v13.02,20.64
  Bottom 0.152: v13.02,20.64 13.02,18.73 12.37,18.09 J5.5
DAC_WS
  Top 0.152: U1.2 14.96,25.36 arc-90 14.61,25.72 14.61,29.62 arc-90 14.73,29.74 15.22,29.74 arc90 15.66,30.18 15.66,31.19 arc-90 15.83,31.35 21.31,31.35 22.46,32.5 23.38,32.5 J4.10
DEEM  (via drill 0.2)
  Top 0.152: U1.9 10.82,29.18 10.85,29.21 | v9.53,29.85 9.53,29.53 9.84,29.21 10.85,29.21 | R5.2 12.06,30.8 arc-90 12.38,30.48 12.38,29.53 arc-90 12.06,29.21 10.85,29.21
  Bottom 0.152: v9.53,29.85 9.37,30.01 9.37,32.07 10.16,32.86 10.16,33.97 9.69,34.44 3.98,34.44 3.94,34.48 arc-90 1.91,36.51 1.91,40.76 arc-90 3.69,42.55 8.44,42.55 arc90 8.99,43.09 J8.4
GAIN1  (via drill 0.2)
  Top 0.152: JP1.2 JP1.4 JP1.6 JP1.8 | v17.78,19.05 17.95,19.05 21.62,22.72 21.62,26.06 arc-90 21.88,26.32 23.2,26.32 arc90 23.41,26.54 U2.P$5
  Bottom 0.152: v17.78,19.05 17.78,16.51 17.6,16.33 3.91,16.33 1.88,14.3 1.88,10.54 3.92,8.5 9.73,8.5 10.16,8.07 10.16,6.03 9.53,5.4 6.03,5.4 5.18,4.55 5.18,2.22 5.82,1.59 JP1.8
GND  (via drill 0.2)
  Top 0.254: S6.3 30.8,33.82 v30.8,35.72 30.8,36.98 S6.4 | v20,30.8 20,29.98 R4.1 R1.1 R7.1 | U1.5 v15.24,27.31 | v14.92,31.12 14.61,30.8 R6.1 | v9.84,30.8 R5.1 | R12.1 v13.65,9.21 | v28.57,6.03 30.89,6.03 SD1.GND | C11.2 v13.34,12.38 | C12.2 v13.34,10.8 | U2.P$1 25.12,26.99 v25.72,26.99 | v22.23,25.4 U2.P$THERMAL | U2.P$8 22.61,23.25 v22.54,23.18 | C18.2 24.26,20.8 v24.84,20.8 25.31,20.8 C17.2 | R16.1 v7.46,9.21 | C2.2 arc90 20.3,23.57 C1.2 arc-90 18.66,23.5 v17.78,23.5 | FB1.1 v5.24,28.89 arc-90 v5.24,28.89 | R22.1 v29.69,23.18 | R3.1 3.94,33.32 arc90 J4.2 | C5.2 14.61,37.11 v14.61,36.36 | v19.05,35.88 C6.2 | R2.1 v20.32,40.32 | R9.1 13.79,13.65 v13.34,13.65 | v11.59,36.87 11.59,36.23 C20.2 | C21.2 12.85,38.39 v12.31,38.39 12.3,38.4 U4.2 11.25,38.4 U4.5 | v13.65,39.73 13.43,39.51 U3.4 U3.3 | U3.3 11.68,40.71 U3.P$1 12.18,41.71 U3.9 | S3.3 v5.55,51.48 v5.56,51.47 v5.55,51.47 S3.4 | S2.4 v11.27,51.47 v11.27,51.48 S2.3 | S1.3 v16.98,51.48 v16.99,51.47 v16.98,51.47 S1.4 | C19.2 8.02,41.32 v8.02,42.04 | U3.2 U3.3
  pour GND (rank 2): -0.64,54.93 -0.64,-0.47 33.34,-0.47 33.34,54.93
GPIO21
  Bottom 0.152: J5.6 12.56,16.57 3.81,16.57 1.59,14.35 1.59,10.48 3.81,8.26 8.26,8.26 8.99,7.52 J6.4
GPIO27  (via drill 0.2)
  Top 0.152: v27.81,38.39 v31.5,38.39
  Bottom 0.152: v31.5,38.39 arc-90 32.07,37.82 32.07,31.75 arc-90 30.16,29.85 29.84,29.85 arc45 28.3,29.21 arc45 27.64,27.62 27.64,20.9 25.88,19.14 25.88,12.55 18.67,5.34 12.86,5.34 11.53,6.67 J6.5 | v27.81,38.39 27.63,38.39 arc90 27.15,37.9 27.15,31.69 arc-90 26.74,31.29 22.05,31.29 arc-45 20.63,31.87 J4.8
MIC_BCK  (via drill 0.2)
  Top 0.152: J4.6 14.07,32.6 14.61,32.07 17.25,32.07 17.83,32.65 17.83,34.02 18.41,34.61 19.21,34.61 19.68,35.09 v19.68,36.51
  Bottom 0.152: IC1.4 18.26,37.13 18.26,36.67 18.41,36.51 v19.68,36.51 20.48,36.51 arc90 20.8,36.83 20.8,40.42 arc90 20.41,40.8 17.25,40.8 arc-90 16.93,41.12 16.93,44.45 J8.7
MIC_DOUT  (via drill 0.2)
  Top 0.152: J4.7 16.61,34.19 16.19,34.61 14.29,34.61 13.97,34.93 13.97,37.78 14.61,38.42 R8.1 14.74,39.13 v14.76,39.15
  Bottom 0.152: v14.76,39.15 14.76,40.96 11.53,44.19 J8.5
MIC_WS  (via drill 0.2)
  Top 0.152: J4.5 11.53,34.94 12.15,35.56 13.34,35.56 13.65,35.88 13.65,39.05 14.13,39.53 16.19,39.53 16.51,39.21 v16.51,39.05
  Bottom 0.152: IC1.1 17.28,39.05 v16.51,39.05 16.51,41.12 14.07,43.56 J8.6
MISO
  Top 0.152: SD1.MISO 26.88,4.87 22.54,9.21 R12.2 15.42,3.36 14.92,2.86 5.71,2.86 3.91,4.66 J6.2 2.26,8.64 2.26,17.21 3.14,18.09 J5.2
MOSI
  Top 0.152: SD1.MOSI 24.39,9.27 19.05,14.61 15.74,14.61 R9.2 15.11,14.11 14.61,14.61 8.26,14.61 7.62,15.24 7.62,18.46 6.9,19.18 2.46,19.18 J5.1 J6.1
MUTE  (via drill 0.2)
  Top 0.152: U1.8 17.52,29.26 arc90 17.78,29.53 arc-90 18.1,29.85 R4.2 18.87,30.62 v18.89,30.64
  Bottom 0.152: J8.8 19.15,41.33 19.44,41.04 27.12,41.04 27.46,40.7 27.46,39.53 28.19,38.8 28.19,38.23 27.46,37.5 27.46,31.5 27.18,31.21 27.17,31.21 26.82,30.86 26.82,30.61 26.55,30.33 19.67,30.33 19.37,30.64 v18.89,30.64
N$1
  Top 0.152: FB2.1 8.57,24.77 arc90 8.74,24.93 8.74,26.19 arc90 8.73,26.2 8.73,26.35 arc-90 9.05,26.67 | U1.13 arc90 U1.13 9.05,26.67 | C4.1 7.9,26.67 | 7.9,26.67 7.9,26.56 C3.1 | 9.05,26.67 7.9,26.67
N$2
  Top 0.254: U2.P$3 24.21,27.39 arc-90 24.45,27.62 25.4,27.62 arc90 25.88,28.1 C15.1
N$3
  Top 0.152: R1.2 18.39,28.26 arc-90 18.2,28.46 arc90 18.04,28.61 U1.7
N$4
  Top 0.254: U2.P$7 22.61,27.55 arc90 22.54,27.62 22.23,27.62 arc-90 21.96,27.89 C16.1
N$5
  Top 0.152: U1.11 9.82,27.96 arc-90 9.53,28.26 9.53,28.89 arc90 9.21,29.21 arc-90 9.02,29.4 9.02,31.62 arc90 8.38,32.26 5.59,32.26 arc90 5.08,31.75 5.08,30.93 arc-90 R3.2
N$8
  Top 0.152: R22.2 28.07,21.79 PWR.C
N$10
  Top 0.152: R6.2 13.15,29.03 arc-90 12.7,28.58 10.77,28.58 U1.10
N$11
  Top 0.152: U1.6 17.76,27.96 arc-90 18.1,27.62 arc90 18.41,27.31 18.73,27.31 arc-90 18.87,27.17 R7.2
N$14
  Top 0.152: U1.12 9.2,27.31 arc-90 8.89,27.62 8.89,28.26 arc90 8.57,28.58 8.26,28.58 arc-90 7.94,28.89 7.94,29.34 arc90 C9.1 arc90 7.94,29.41 7.94,30.56 arc90 C10.1
N$15
  Top 0.254: U1.14 12.72,26.01 arc-90 13.02,25.72 13.02,24.77 arc-90 12.7,24.45 12.06,24.45 arc90 11.84,24.22 C7.1
N$16
  Top 0.254: R11.2 6.35,22.86 arc-90 6.67,22.54 6.67,22 arc90 C8.2
N$17  (via drill 0.35)
  Top 0.254: U2.P$9 23.01,21.11 arc-90 22.23,20.32 21.27,20.32 arc90 20.32,19.37 v20.32,17.46
  Bottom 0.254: v20.32,17.46 20.32,15.24 arc-90 19.8,14.72 4.45,14.72 arc90 J2.2
N$18  (via drill 0.35)
  Top 0.254: U2.P$14 arc90 25.44,23.5 26.32,23.5 arc90 26.64,23.82 26.64,30.51 arc90 v26.35,30.8
  Bottom 0.254: v26.35,30.8 20.95,30.8 arc-90 20.32,31.43 arc90 20,31.75 18.73,31.75 arc-90 17.78,32.7 17.78,33.97 arc90 16.99,34.77 3.97,34.77 arc-90 2.22,36.51 2.22,39.48 arc-90 J1.2
N$19
  Top 0.152: 15.02,22.09 arc90 C7.2
  Top 0.254: 15.02,22.09 R10.2
N$20  (via drill 0.2)
  Top 0.152: v17.78,40.01 18.1,40.32 R2.2
  Bottom 0.152: IC1.2 17.78,39.4 v17.78,40.01
N$21
  Top 0.152: 9.53,22.14 arc90 C8.1
  Top 0.254: U1.16 9.79,24.71 arc90 9.53,24.45 9.53,22.14
N$22  (via drill 0.2)
  Top 0.152: v16.51,38.42 R8.2
  Bottom 0.152: v16.51,38.42 16.54,38.42 16.86,38.1 IC1.6
N$24
  Top 0.152: R17.1 10.61,8.57 10.93,8.26 12.2,8.26 12.8,7.65 12.8,4.76 13.44,4.13 JP1.1
N$25
  Top 0.152: R16.2 9.39,9.21 10.31,8.29 10.31,4.6 9.84,4.13 JP1.5
N$26  (via drill 0.35)
  Top 0.254: U2.P$13 24.61,23.65 arc90 25.18,23.08 26.38,23.08 arc90 27.09,23.78 27.09,31.41 arc90 v26.67,31.83
  Bottom 0.254: J1.1 3.81,36.51 arc90 5.08,35.24 19.09,35.24 arc-90 20.32,34.01 20.32,33.79 arc90 22.28,31.83 v26.67,31.83
N$27
  Top 0.152: R14.2 28.07,19.55 SDCRD.C
N$28  (via drill 0.35)
  Top 0.254: U2.P$10 23.41,19.68 arc-90 23.16,19.43 arc90 22.87,19.14 v22.87,17.45
  Bottom 0.254: v22.87,17.45 22.87,14.91 arc-90 22.19,14.23 7.14,14.23 arc90 6.35,13.44 6.35,11.43 arc-90 5.5,10.58 J2.1
P0
  Top 0.152: U3.5 16.87,40.21 20.42,43.76 20.42,46.99 20.1,47.31 J3.1
P1
  Top 0.152: U3.6 16.89,40.71 17.88,41.7 17.88,46.99 17.56,47.31 J3.2
P2
  Top 0.152: J3.3 15.02,47.31 15.34,46.99 15.34,41.54 15.01,41.21 U3.7
P3
  Top 0.152: U3.8 12.88,46.97 12.54,47.31 J3.4
P4
  Top 0.152: U3.10 11.68,42.77 10.16,44.29 10.16,46.99 9.84,47.31 J3.5
P5
  Top 0.152: U3.11 11.18,42.93 10.68,43.43 8.32,43.43 7.78,43.98 7.78,45.4 6.45,46.73 J3.6 6.45,47.89 7.02,48.45 17.34,48.45 18.27,49.39 S1.1 S1.2
P6
  Top 0.152: U3.12 10.68,42.98 10.47,43.19 5.71,43.19 5.24,43.66 5.24,45.25 3.91,46.57 J3.7 3.91,48.12 4.29,48.49 6.55,48.49 6.75,48.69 12.62,48.69 12.87,48.94 S2.1 S2.2
P7
  Top 0.152: U3.13 9.41,41.71 9.29,41.83 9.29,42.49 8.83,42.95 3.25,42.95 2.7,43.5 2.7,45.72 2.38,46.04 1.75,46.04 1.37,46.41 J3.8 1.37,48.36 1.74,48.73 6.13,48.73 6.25,48.85 6.25,49.12 6.52,49.39 S3.1 S3.2
RESET
  Top 0.152: S6.1 S6.2 28.73,30.63 27.73,29.64 27.73,24.32 27.38,23.97 27.38,17.54 26.67,16.83 22.23,16.83 21.69,17.36 J5.9
SCK
  Top 0.152: 6.13,11.01 6.99,10.16 22.23,10.16 25.32,7.07 SD1.SCK 31.52,7.08 31.95,7.51 31.95,18.21 30.48,19.69 SDCRD.A | J5.3 6.13,17.77 6.13,11.01 | 6.13,11.01 6.13,7.3 J6.3
SCL
  Top 0.152: J5.8 19.15,17.25 18.76,16.85 15.53,16.85 15.24,17.15 15.24,19.05 14.85,19.45 3.71,19.45 arc-90 2.58,20.58 2.58,34.35 arc-90 3.08,34.85 4.92,34.85 arc90 5.4,35.33 5.4,36.45 arc-90 5.94,36.99 7.94,36.99 arc90 8.1,37.15 R20.1 7.17,37.6 arc-90 6.78,37.99 6.78,42.5 arc-90 6.99,42.71 8.57,42.71 9.05,42.23 9.05,40.8 9.21,40.64 9.91,40.64 U3.15
  Bottom 0.152: J6.7 17.78,5.82 18.47,5.82 25.4,12.75 25.4,19 25.03,19.37 19.68,19.37 19.15,18.84 J5.8
SD_CS
  Top 0.152: J5.4 8.99,15.46 9.53,14.92 14.74,14.92 | 14.74,14.92 19.37,14.92 23.92,10.37 29.53,10.37 | R14.1 29.07,17.31 27.73,15.96 27.73,12.17 29.53,10.37 | R13.1 14.74,14.92 | SD1.CS 29.53,10.37
SDA
  Top 0.152: J5.7 16.61,19.27 16.19,19.69 3.81,19.69 arc-90 2.82,20.68 2.82,34.25 arc-90 3.17,34.61 4.98,34.61 arc90 5.68,35.31 5.68,36.37 arc-90 5.98,36.67 9.21,36.67 arc90 9.37,36.83 R21.1 8.82,37.6 arc-90 8.65,37.77 8.65,38.98 arc90 8.41,39.21 7.48,39.21 arc-90 7.05,39.64 7.05,42.23 arc-90 7.28,42.46 8.47,42.46 8.81,42.13 8.81,40.38 8.98,40.21 U3.16
  Bottom 0.152: J6.6 15.48,5.58 18.57,5.58 25.64,12.65 25.64,19.13 25.16,19.61 17.07,19.61 16.61,19.15 J5.7
SHUTDOWN
  Top 0.152: U2.P$2 24.61,26.51 arc90 24.82,26.3 25.13,26.3 arc-90 25.4,26.04 25.4,24.77 arc-90 25.13,24.5 22.28,24.5 arc90 21.91,24.13 R15.2
VINL
  Top 0.254: X1.4 26.67,48.15 26.67,32.63 25.72,31.68 25.72,30.05 C15.2 25.72,29.73 24.62,29.73 R18.2
VINR
  Top 0.254: X1.3 26.31,43.71 26.31,32.81 24.94,31.43 22.85,31.43 21.96,30.55 C16.2 22.12,29.73 23.32,29.73 R19.2
VOUTL
  Top 0.254: X1.5 23.86,52.71 22.23,51.08 22.23,37.47 25.38,34.32 25.38,32.86 24.72,32.21 22.58,32.21 20.96,30.59 20.96,22.99 18.97,20.99 C13.1 16.77,20.99 R10.1
VOUTR
  Top 0.254: R11.1 3.69,22.76 C14.1 3.69,20.45 arc90 4.13,20 18.48,20 21.31,22.84 21.31,30.46 22.66,31.8 24.82,31.8 25.72,32.7 25.72,34.46 24.81,35.37 X1.2

### Text on the board
bPlace: http://www.aksevenfour.com
tNames: MIC / PORT | RESET
bNames: FREE PINS | P7 | P6 | P5 | P4 | P3 | P2 | P1 | P0 | 3V3 | 5V | GND | DE | 15 | 4 | 14 | MUTE | I2S MIC | - | LEFT | + | BAT | GND | 5V | 3V3 | 4 | 14 | 15 | 27 | 26 | 25 | TinyPICO Audio Board | 23 | 19 | 18 | 5 | 22 | 21 | 32 | 33 | RST | GND | INFO | - | SPH0645LM4H / UDA1334A / MAX98306 / PCF8574 / v0.13 - 07/19 / Adam Keher | RIGHT | + | FREE PINS | MO | MI | SCK | 21 | 27 | SDA | SCL | GAIN | 18dB | 15dB | 12dB | 9dB | DAC: / MIC: / AMP: / EXP: / VER: